# Altium schematic sheet HPS_Arria10.SchDoc: HPS Shared IOs
size B; DocumentNumber: 25; SheetNumber: 25; SheetTotal: 46
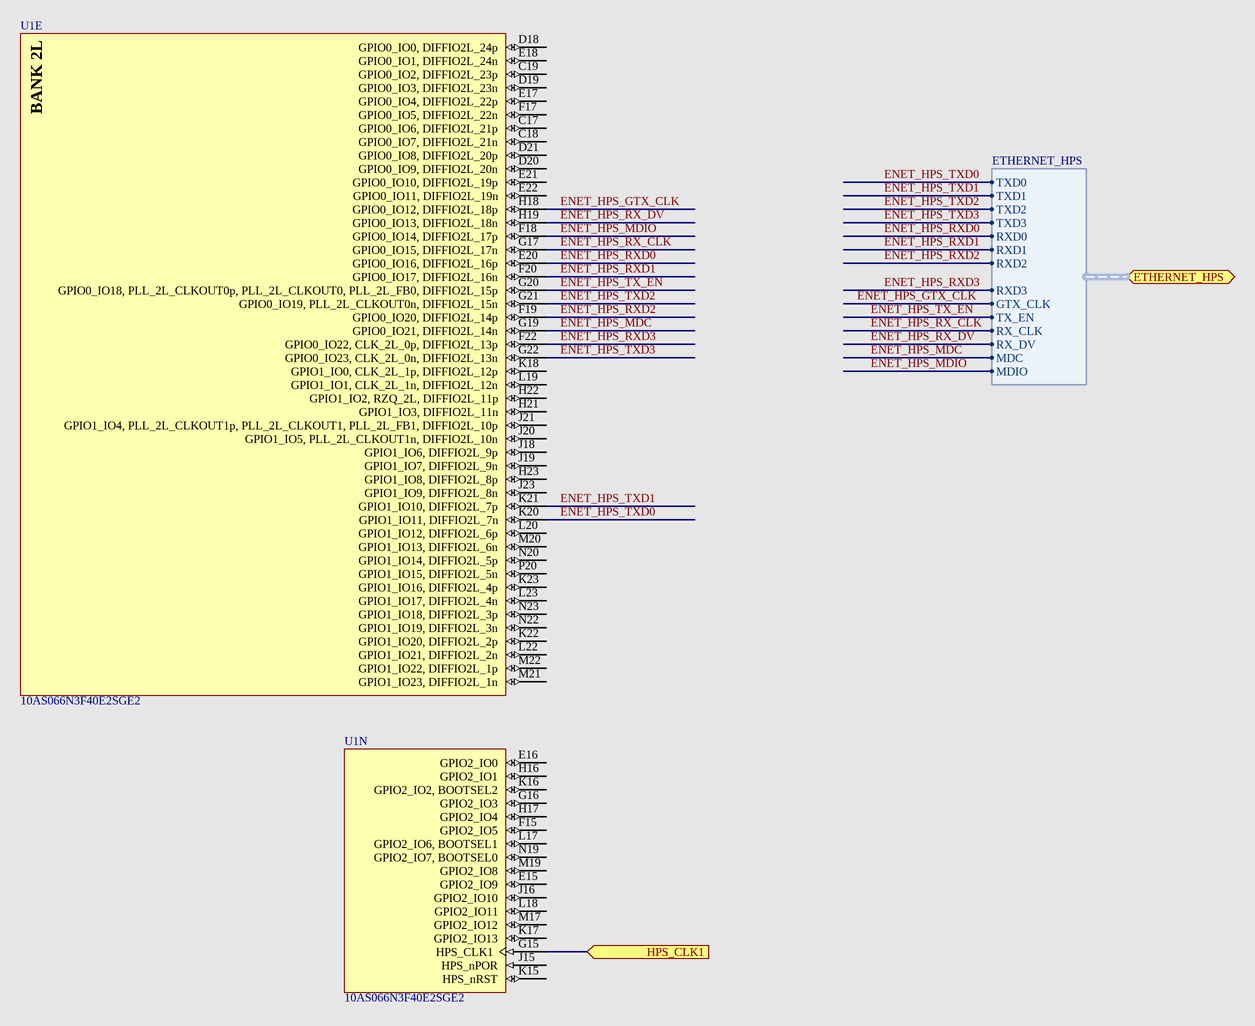
[diagram p0: HPS_Arria10.SchDoc]

## Parts
U1  10AS066N3F40E2SGE2  [ALTR-FBGA1517_A-350]  (parts E,N of 31)

## Ports
ETHERNET_HPS (harness ETHERNET_HPS), HPS_CLK1 (in)

## Harnesses
ETHERNET_HPS: RXD2, RXD1, RXD0, TXD3, TXD2, TXD1, TXD0, RXD3, GTX_CLK, TX_EN, RX_DV, RX_CLK, MDC, MDIO

## Nets
ENET_HPS_GTX_CLK: U1.H18(GPIO0_IO12,_DIFFIO2L_18p) ; port ETHERNET_HPS.GTX_CLK
ENET_HPS_MDC: U1.G19(GPIO0_IO21,_DIFFIO2L_14n) ; port ETHERNET_HPS.MDC
ENET_HPS_MDIO: U1.F18(GPIO0_IO14,_DIFFIO2L_17p) ; port ETHERNET_HPS.MDIO
ENET_HPS_RX_CLK: U1.G17(GPIO0_IO15,_DIFFIO2L_17n) ; port ETHERNET_HPS.RX_CLK
ENET_HPS_RX_DV: U1.H19(GPIO0_IO13,_DIFFIO2L_18n) ; port ETHERNET_HPS.RX_DV
ENET_HPS_RXD0: U1.E20(GPIO0_IO16,_DIFFIO2L_16p) ; port ETHERNET_HPS.RXD0
ENET_HPS_RXD1: U1.F20(GPIO0_IO17,_DIFFIO2L_16n) ; port ETHERNET_HPS.RXD1
ENET_HPS_RXD2: U1.F19(GPIO0_IO20,_DIFFIO2L_14p) ; port ETHERNET_HPS.RXD2
ENET_HPS_RXD3: U1.F22(GPIO0_IO22,_CLK_2L_0p,_DIFFIO2L_13p) ; port ETHERNET_HPS.RXD3
ENET_HPS_TX_EN: U1.G20(GPIO0_IO18,_PLL_2L_CLKOUT0p,_PLL_2L_CLKOUT0,_PLL_2L_FB0,_DIFFIO2L_15p) ; port ETHERNET_HPS.TX_EN
ENET_HPS_TXD0: U1.K20(GPIO1_IO11,_DIFFIO2L_7n) ; port ETHERNET_HPS.TXD0
ENET_HPS_TXD1: U1.K21(GPIO1_IO10,_DIFFIO2L_7p) ; port ETHERNET_HPS.TXD1
ENET_HPS_TXD2: U1.G21(GPIO0_IO19,_PLL_2L_CLKOUT0n,_DIFFIO2L_15n) ; port ETHERNET_HPS.TXD2
ENET_HPS_TXD3: U1.G22(GPIO0_IO23,_CLK_2L_0n,_DIFFIO2L_13n) ; port ETHERNET_HPS.TXD3
HPS_CLK1: U1.G15(HPS_CLK1) ; port HPS_CLK1

Not connected (* = marked no-connect by the designer): U1 C17(GPIO0_IO6,_DIFFIO2L_21p) C18(GPIO0_IO7,_DIFFIO2L_21n) C19(GPIO0_IO2,_DIFFIO2L_23p) D18(GPIO0_IO0,_DIFFIO2L_24p) D19(GPIO0_IO3,_DIFFIO2L_23n) D20(GPIO0_IO9,_DIFFIO2L_20n) D21(GPIO0_IO8,_DIFFIO2L_20p) E15(GPIO2_IO9) E16(GPIO2_IO0) E17(GPIO0_IO4,_DIFFIO2L_22p) E18(GPIO0_IO1,_DIFFIO2L_24n) E21(GPIO0_IO10,_DIFFIO2L_19p) E22(GPIO0_IO11,_DIFFIO2L_19n) F15(GPIO2_IO5) F17(GPIO0_IO5,_DIFFIO2L_22n) G16(GPIO2_IO3) H16(GPIO2_IO1) H17(GPIO2_IO4) H21(GPIO1_IO3,_DIFFIO2L_11n) H22(GPIO1_IO2,_RZQ_2L,_DIFFIO2L_11p) H23(GPIO1_IO8,_DIFFIO2L_8p) J15(HPS_nPOR) J16(GPIO2_IO10) J18(GPIO1_IO6,_DIFFIO2L_9p) J19(GPIO1_IO7,_DIFFIO2L_9n) J20(GPIO1_IO5,_PLL_2L_CLKOUT1n,_DIFFIO2L_10n) J21(GPIO1_IO4,_PLL_2L_CLKOUT1p,_PLL_2L_CLKOUT1,_PLL_2L_FB1,_DIFFIO2L_10p) J23(GPIO1_IO9,_DIFFIO2L_8n) K15(HPS_nRST) K16(GPIO2_IO2,_BOOTSEL2) K17(GPIO2_IO13) K18(GPIO1_IO0,_CLK_2L_1p,_DIFFIO2L_12p) K22(GPIO1_IO20,_DIFFIO2L_2p) K23(GPIO1_IO16,_DIFFIO2L_4p) L17(GPIO2_IO6,_BOOTSEL1) L18(GPIO2_IO11) L19(GPIO1_IO1,_CLK_2L_1n,_DIFFIO2L_12n) L20(GPIO1_IO12,_DIFFIO2L_6p) L22(GPIO1_IO21,_DIFFIO2L_2n) L23(GPIO1_IO17,_DIFFIO2L_4n) M17(GPIO2_IO12) M19(GPIO2_IO8) M20(GPIO1_IO13,_DIFFIO2L_6n) M21(GPIO1_IO23,_DIFFIO2L_1n) M22(GPIO1_IO22,_DIFFIO2L_1p) N19(GPIO2_IO7,_BOOTSEL0) N20(GPIO1_IO14,_DIFFIO2L_5p) N22(GPIO1_IO19,_DIFFIO2L_3n) N23(GPIO1_IO18,_DIFFIO2L_3p) P20(GPIO1_IO15,_DIFFIO2L_5n)

## Notes on the sheet
- Title
- Size:
- Date:
- B
- Number:
- Time:
- Revision:
- Sheet
- of
- File:
- (in symbol CMP-1689-00006-3, part E) BANK 2L

## Library data of the parts
U1 = CMP-1689-00006-3: Arria 10 SX Family, 588 I/O Pins, 16 Fractional PLLs, 1517-Pin FBGA, Speed Grade 2, Extended Grade, RoHS; ComponentLink3Description: Package Specification; PackageVersion: Rev. 5.0, 01/2016; ComponentLink3URL: https://www.altera.com/content/dam/altera-www/global/en_US/pdfs/literature/packaging/04r00461-04.pdf; ComponentLink2Description: Datasheet; Code_JEDEC: MS-034; Mounting Technology: Surface Mount; PartNumber: 10AS066N3F40E2SGE2; PackageDescription: 1517-Pin FineLine Ball-Grid Array (FBGA), Body 40 x 40 mm, Pitch 1 mm; ComponentLink2URL: https://www.altera.com/content/dam/altera-www/global/en_US/pdfs/literature/hb/arria-10/a10_datasheet.pdf; ComponentLink1URL: https://www.altera.com/; DatasheetVersion: Rev. 2016-06-24, 06/2016; ComponentLink1Description: Manufacturer URL